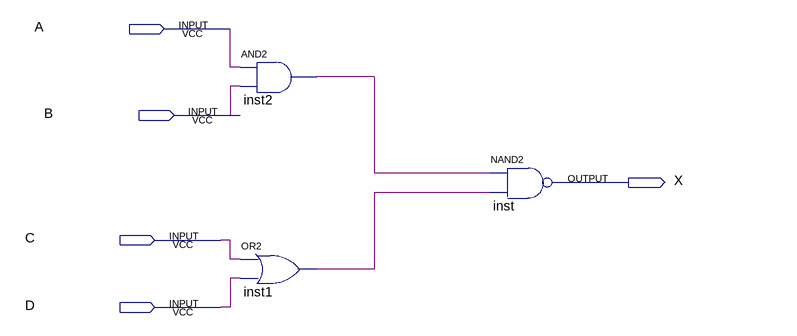
[diagram p0: schematic sheet]
// Quartus schematic LetraA.bdf as structural Verilog: 3 symbols, 5 pins
module LetraA (
  input  A,
  input  B,
  input  C,
  input  D,
  output X
);

  wire inst1_out, inst2_out;

  and inst2 (inst2_out, A, B);
  or inst1 (inst1_out, C, D);
  nand inst (X, inst2_out, inst1_out);
endmodule
